# Altium schematic sheet PDB_OS3_AlimentationV2.SchDoc
size A4; SheetNumber: 1; SheetTotal: 1; SPICEModelCacheXDJPSUFR: <root> / <DocumentId>XDJPSUFR</DocumentId> / </root>
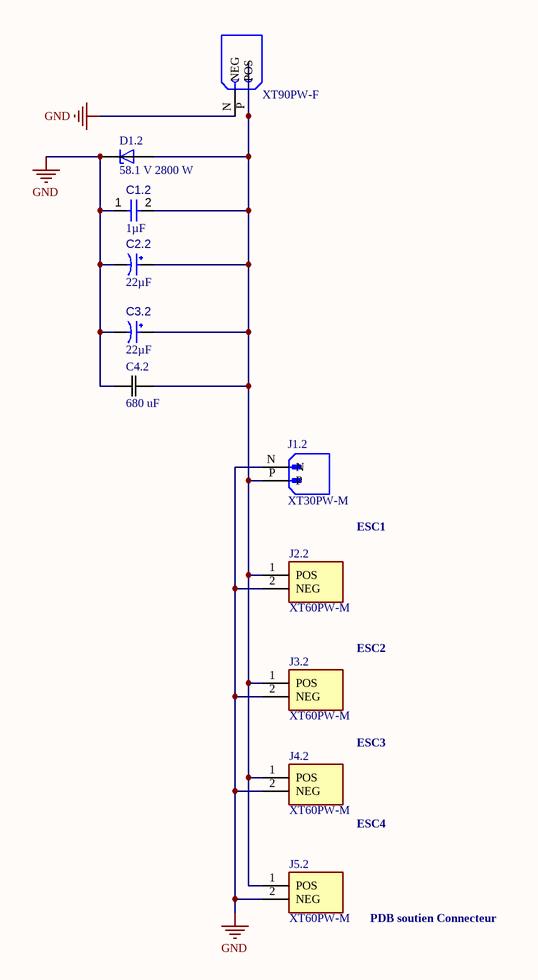
[diagram p0: PDB_OS3_AlimentationV2.SchDoc]

## Parts
?  XT90PW-F  [AMASS_XT90PW-F]
C1.2  value 1µF  [CAPC0603(1608)100_L]  (hidden comment: Capacitor 1µF +/-40% 50V 0603)
C2.2  value 22µF  [CAPPR55-200-1100X500X1200]  (hidden comment: ECA1HM220)
C3.2  value 22µF  [CAPPR55-200-1100X500X1200]  (hidden comment: ECA1HM220)
C4.2  680 uF  [CAP_PY-13x20_KEM]
D1.2  58.1 V 2800 W  [TVSP_TLD8S36AH]
J1.2  XT30PW-M  [AMASS_XT30PW-M]
J2.2  XT60PW-M  [AMASS_XT60PW-M]
J3.2  XT60PW-M  [AMASS_XT60PW-M]
J4.2  XT60PW-M  [AMASS_XT60PW-M]
J5.2  XT60PW-M  [AMASS_XT60PW-M]

## Nets
GND: ?.N(NEG) C1.2.1 C2.2.2 C3.2.2 C4.2.2 D1.2.C J1.2.N J2.2.2(NEG) J3.2.2(NEG) J4.2.2(NEG) J5.2.2(NEG)
Net?_P: ?.P(POS) C1.2.2 C2.2.1 C3.2.1 C4.2.1 D1.2.A J1.2.P J2.2.1(POS) J3.2.1(POS) J4.2.1(POS) J5.2.1(POS)

## Notes on the sheet
- ESC1
- ESC2
- ESC3
- ESC4
- PDB soutien Connecteur

## Library data of the parts
? = XT90PW-F: Socket, DC supply, XT90, female, PIN:2, on PCBs, THT; MF: AMASS; SnapEDA_Link: https://www.snapeda.com/parts/XT90PW-F/AMASS/view-part/?ref=snap; Package: Package; Value: *; MP: XT90PW-F; Check_prices: https://www.snapeda.com/parts/XT90PW-F/AMASS/view-part/?ref=eda
C1.2 = CMP-001-00078-4: Chip Capacitor, 1µF +/-40%, 50V, 0603, Thickness 1 mm; Tolerance: 10%; Case/Package: 0603; Pins: 2; Max Operating Temperature: 85°C; Voltage Rating: 50V; Mounting Technology: SMT; Min Operating Temperature: -55°C; ComponentLink1Description: Manufacturer Link; ComponentLink1URL: https://www.digikey.ca/fr/products/detail/samsung-electro-mechanics/CL10A105KB8NNNC/3887518?msockid=24619636816564831ea7832b805e650e
C2.2 C3.2 = CMP-001-00027-7: Aluminum Electrolytic Capacitor, 22 uF, +/- 20%, 50 V, -40 to 85 degC, 2-Pin THD, RoHS, Bulk; Manufacturer: Panasonic; Ripple Current (AC): 100mA; Voltage Rating: 50V; Pins: 2; Case/Package: Radial; Datasheet Version: Rev. 05, 10/2016; RoHS Compliant: True; Max Operating Temperature: 85°C; Ripple Current: 100mA; Capacitor Type: Electrolytic; Mounting Technology: TH; Package Quantity: 200; Package Reference: CAPPR55-200-1100X500X1200; Package Description: 2-Pin Radial Lead, Dia 5 mm, Height 12 mm; Packaging: Bulk; Lead Pitch: 2mm; Min Operating Temperature: -40°C; Diameter: 5mm; Tolerance: 20%; Datasheet URL: https://industrial.panasonic.com/cdbs/www-data/pdf/RDF0000/ABA0000C1218.pdf; Manufacturer URL: http://www.panasonic.com/
C4.2 = CAP_PY-13x20_KEM: 680 uF Capacitor Through Hole; ComponentLink1Description: Manufacturer Link; ComponentLink1URL: 2
D1.2 = TVSP_TLD8S36AH: Diode TVS 2800 W Unidirectionnelle; ComponentLink1Description: Manufacturer Link; ComponentLink1URL: https://www.digikey.ca/en/products/detail/taiwan-semiconductor-corporation/TLD5S36AH/9659228
J1.2 = XT30PW-M: Socket; DC supply; XT30; male; PIN: 2; on PCBs; THT; Colour: yellow; MF: AMASS; SnapEDA_Link: https://www.snapeda.com/parts/XT30PW-M/AMASS/view-part/?ref=snap; Package: None; Value: *; MP: XT30PW-M; Check_prices: https://www.snapeda.com/parts/XT30PW-M/AMASS/view-part/?ref=eda
J2.2 J3.2 J4.2 J5.2 = XT60PW-M: Socket, DC supply, male, PIN: 2; MF: AMASS; Check_prices: https://www.snapeda.com/parts/XT60PW-M/AMASS/view-part/?ref=eda; SnapEDA_Link: https://www.snapeda.com/parts/XT60PW-M/AMASS/view-part/?ref=snap; Price: None; Availability: Not in stock; Package: Package; MP: XT60PW-M; Value: *